# EAGLE design SparkFun_Beefcake_Relay_Control_Kit (EAGLE 7.5.0)
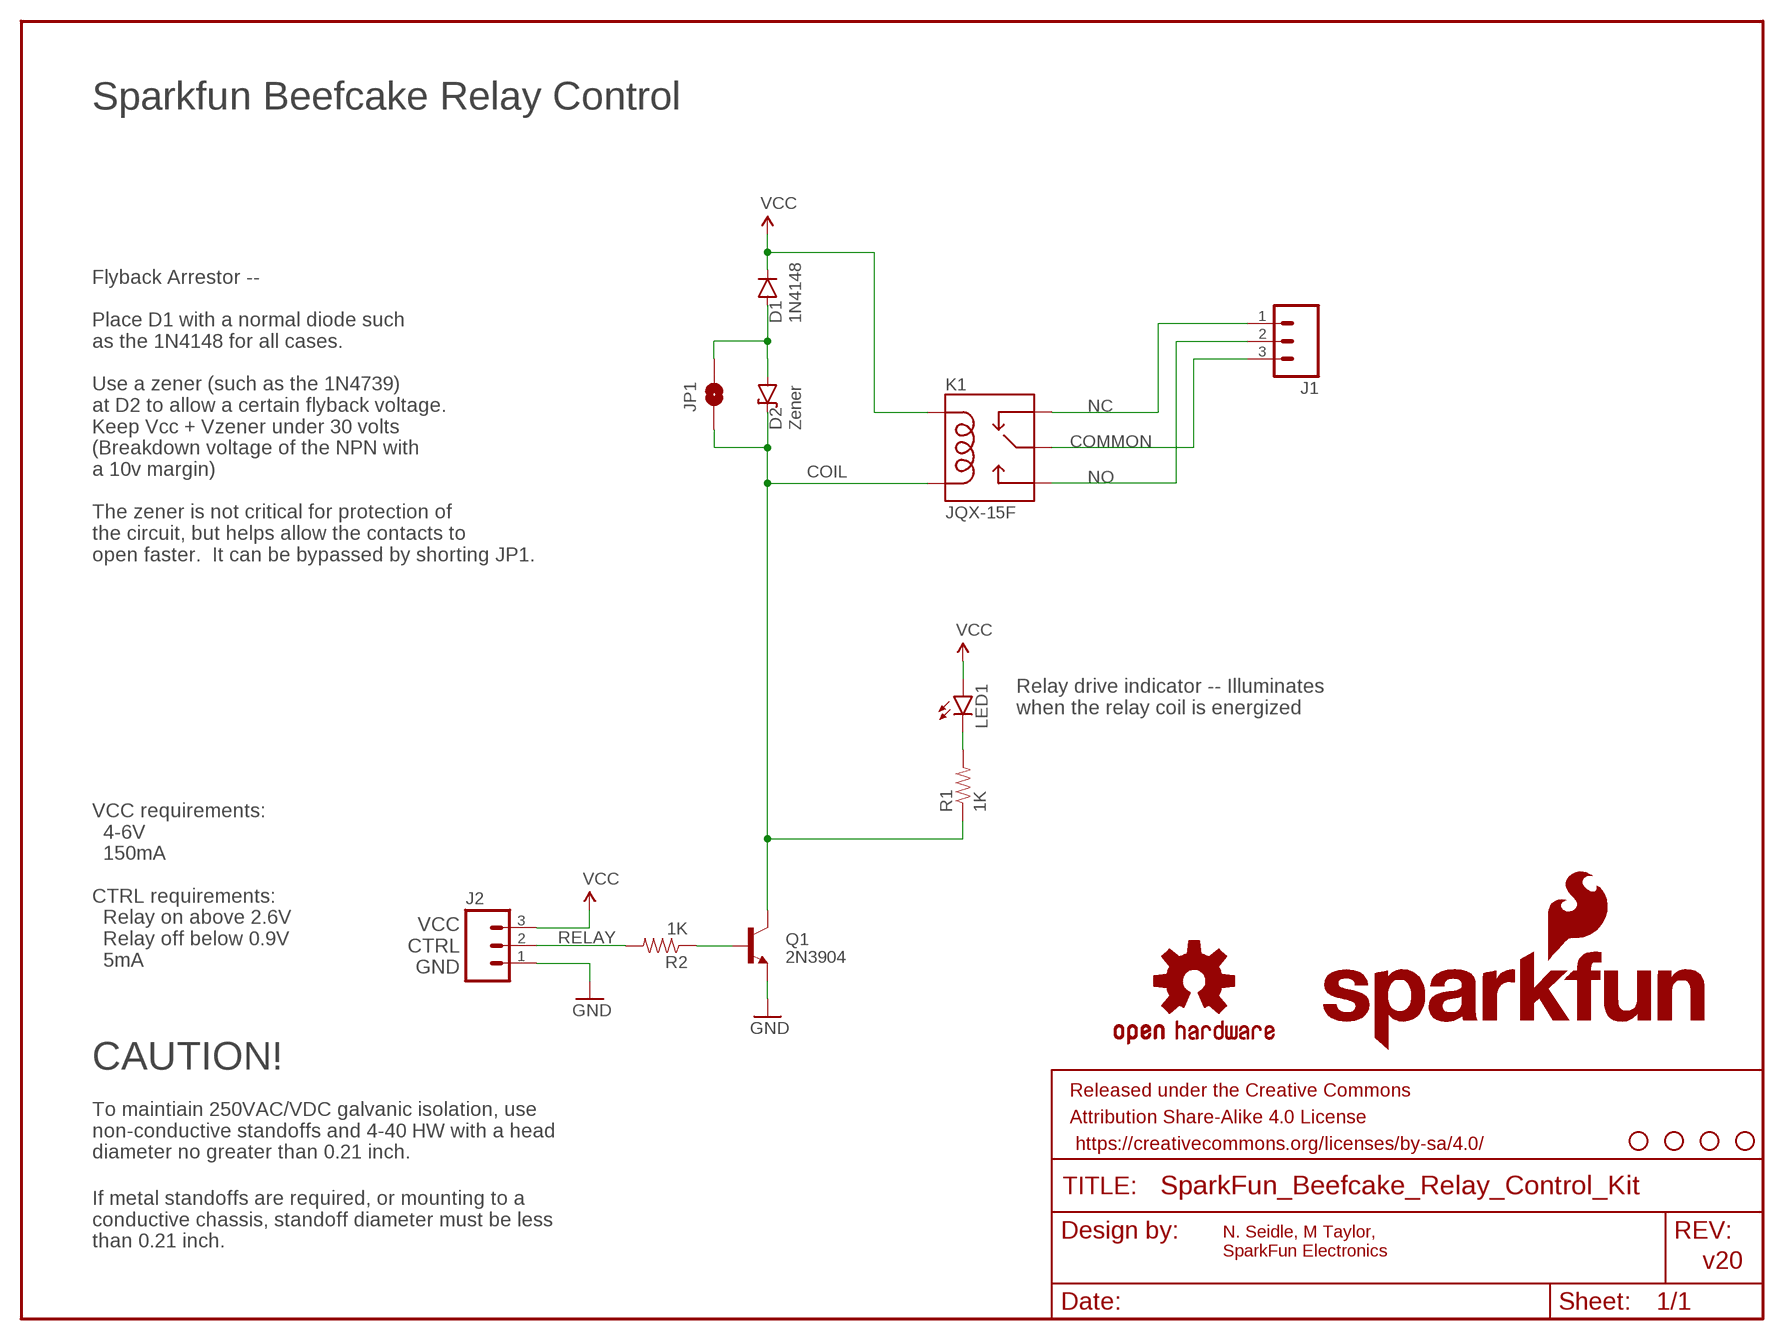
[diagram p0: schematic, sheet 1]

## Parts
D1  1N4148  DIODEKIT  [DIODE-1N4148-KIT]
D2  Zener  DIODE-ZENER  [DIODE-1N4148-KIT]
FRAME2  FRAME-LETTER  [CREATIVE_COMMONS]
J1  M03-SCREW-5MM  [SCREWTERMINAL-5MM-3]
J2  M03SCREW  [SCREWTERMINAL-3.5MM-3]
JP1  JUMPER-PAD-2-NOYES_SILK  [PAD-JUMPER-2-NO_YES_SILK]
K1  JQX-15F  RELAYPTH5  [RELAY-T90]
LED1  LED5MM-KIT  [LED5MM-KIT]
LOGO1  SFE_LOGO_NAME_FLAME.1_INCH  [SFE_LOGO_NAME_FLAME_.1]
Q1  2N3904  TRANSISTOR_NPN2N3904-EZ  [TO-92-EZ]
R1  1K  1KOHM-1/4W-1%(PTH)HORIZ-KIT  [AXIAL-0.3EZ]
R2  1K  1KOHM-1/4W-1%(PTH)HORIZ-KIT  [AXIAL-0.3EZ]
U$3  STAND-OFF  [STAND-OFF]
U$4  STAND-OFF  [STAND-OFF]
U$5  STAND-OFF  [STAND-OFF]
U$7  STAND-OFF  [STAND-OFF]
U$12  OSHW-LOGOS  [OSHW-LOGO-S]

## Nets
COIL: D2.C JP1.1 K1.COIL2 Q1.3(C) R1.P$1
COMMON: J1.3 K1.MAIN
DIODENODE: D1.A D2.A JP1.2
GND: J2.1 Q1.1(E)
N$6: Q1.2(B) R2.P$1
N$9: LED1.K(C) R1.P$2
NC: J1.1 K1.NC
NO: J1.2 K1.NO
RELAY: J2.2 R2.P$2
VCC: D1.C J2.3 K1.COIL1 LED1.A

## Notes on the sheet
- Sparkfun Beefcake Relay Control
- Flyback Arrestor --
  
  Place D1 with a normal diode such
  as the 1N4148 for all cases.
  
  Use a zener (such as the 1N4739)
  at D2 to allow a certain flyback voltage.
  Keep Vcc + Vzener under 30 volts
  (Breakdown voltage of the NPN with
  a 10v margin)
  
  The zener is not critical for protection of
  the circuit, but helps allow the contacts to
  open faster.  It can be bypassed by shorting JP1.
- Relay drive indicator -- Illuminates
  when the relay coil is energized
- VCC requirements:
    4-6V
    150mA
  
  CTRL requirements:
    Relay on above 2.6V
    Relay off below 0.9V
    5mA
- VCC
  CTRL
  GND
- CAUTION!
- To maintiain 250VAC/VDC galvanic isolation, use 
  non-conductive standoffs and 4-40 HW with a head
  diameter no greater than 0.21 inch.
- If metal standoffs are required, or mounting to a
  conductive chassis, standoff diameter must be less
  than 0.21 inch.
- N. Seidle, M Taylor,
  SparkFun Electronics
- v20

## Library data of the parts
D1 = SparkFun-DiscreteSemi:DIODE: Diode These are standard reverse protection diodes and small signal diodes. SMA package can handle up to about 1A. SOD-323 can handle about 200mA. What the SOD-323 package when ordering, there are some mfgs out there that are 5-pin packages.; PROD_ID: DIO-08378
D2 = SparkFun-DiscreteSemi:DIODE-ZENER: Zener Diode Production Part - 8199 3.4V Zener Voltage; PROD_ID: DIO-13313
FRAME2 = SparkFun-Aesthetics:FRAME-LETTER: Schematic Frame Standard 8.5x11 US Letter frame
J1 = SparkFun-Connectors:M03: Header 3 Standard 3-pin 0.1" header. Use with straight break away headers (SKU : PRT-00116), right angle break away headers (PRT-00553), swiss pins (PRT-00743), machine pins (PRT-00117), and female headers (PRT-00115). Molex polarized connector foot print use with SKU : PRT-08232 with associated crimp pins and housings.; PROD_ID: CONN-10134; STOREFRONT_ID: PRT-08433
J2 = SparkFun-Connectors:M03: Header 3 Standard 3-pin 0.1" header. Use with straight break away headers (SKU : PRT-00116), right angle break away headers (PRT-00553), swiss pins (PRT-00743), machine pins (PRT-00117), and female headers (PRT-00115). Molex polarized connector foot print use with SKU : PRT-08232 with associated crimp pins and housings.; PROD_ID: CONN-08288
JP1 = SparkFun-Passives:JUMPER-PAD-2-NO
K1 = SparkFun-Electromechanical:RELAY: SPDT relay (COM-00101); PROD_ID: COMP-10736
LED1 = SparkFun-LED:LED: LEDs Standard schematic elements and footprints for 5mm, 3mm, 1206, and 0603 sized LEDs. 5mm - Spark Fun Electronics SKU : COM-00529 (and others); PROD_ID: DIO-09529
LOGO1 = SparkFun-Aesthetics:SFE_LOGO_NAME_FLAME: SFE Logo, name and flame This is the SparkFun full logo. The logo on the schematic will always be the same size; the package variant is the height of the flame part of the logo. Default layer for the logo on the board is tSilk.
Q1 = SparkFun-DiscreteSemi:TRANSISTOR_NPN: Generic NPN BJT MMBT2222A - TRANS-08049 (SOT-23, 1A 40V) MPSA42 - TRANS-09116 (SOT-23, 500mA 300V) MMBT5088LT1G - TRANS-11160 (SOT-23, 50 mA 30V) BC547 - COM-08928 <http://www.sparkfun.com/products/8928> (TO-92 45V 100mA) (1.Collector 2.Base 3.Emitter) 2N3904 - COM-00521 <http://www.sparkfun.com/products/521> (TO-92 40V 200mA) (1.Emitter 2.Base 3.Collector) P2N2222A - COM-12852 <http://www.sparkfun.com/products/12852> (TO-92 40V 600mA) (1.Collector 2.Base 3.Emitter); PROD_ID: TRANS-08447
R1 R2 = SparkFun-Resistors:1KOHM-1/4W-1%(PTH): RES-12182; PROD_ID: RES-12182
U$3-U$5 U$7 = SparkFun:STAND-OFF: Stand Off This is the mechanical footprint for a #4 phillips button head screw. Use the keepout ring to avoid running the screw head into surrounding components. SKU : PRT-00447
U$12 = SparkFun:OSHW-LOGO: Open Source Hardware Logo This logo indicates the piece of hardware it is found on incorporates a OSHW license and/or adheres to the definition of open source hardware found here: http://freedomdefined.org/OSHW

## Board
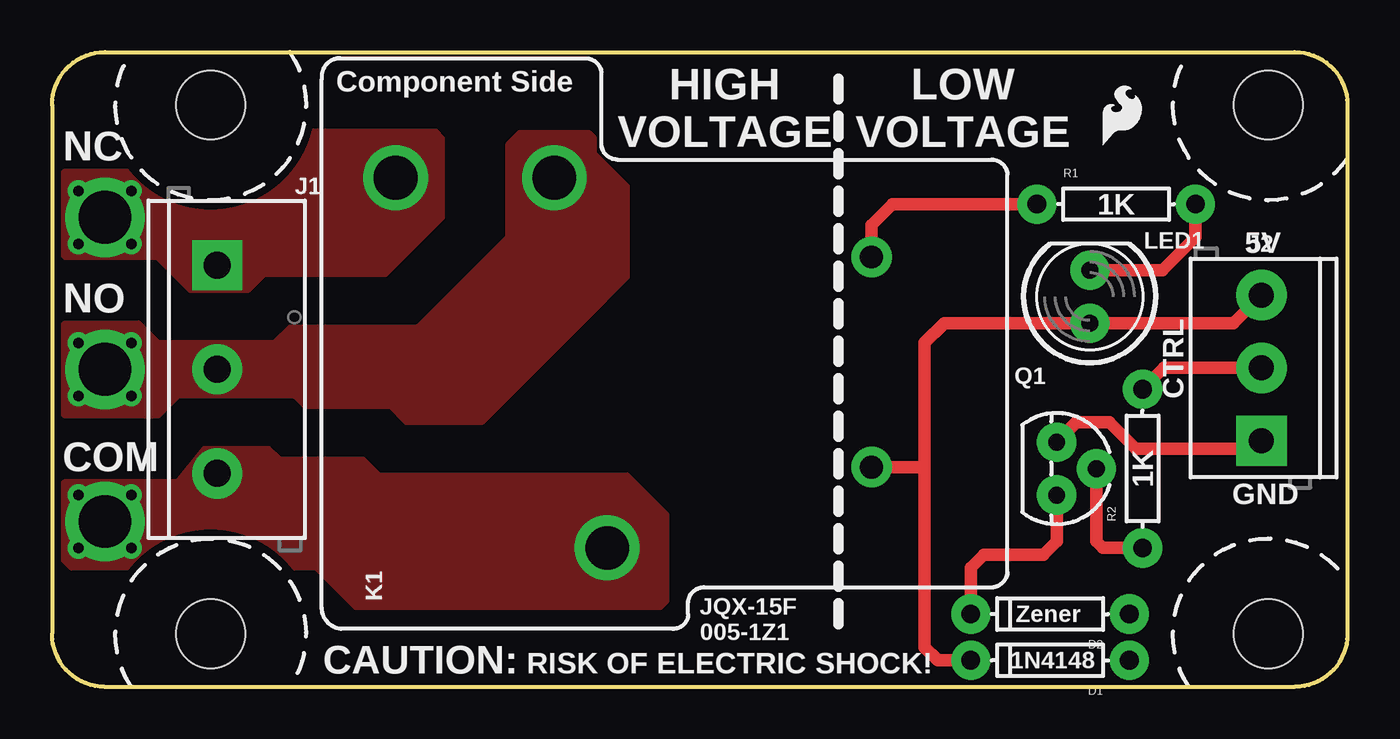
[diagram p1: board, top side]
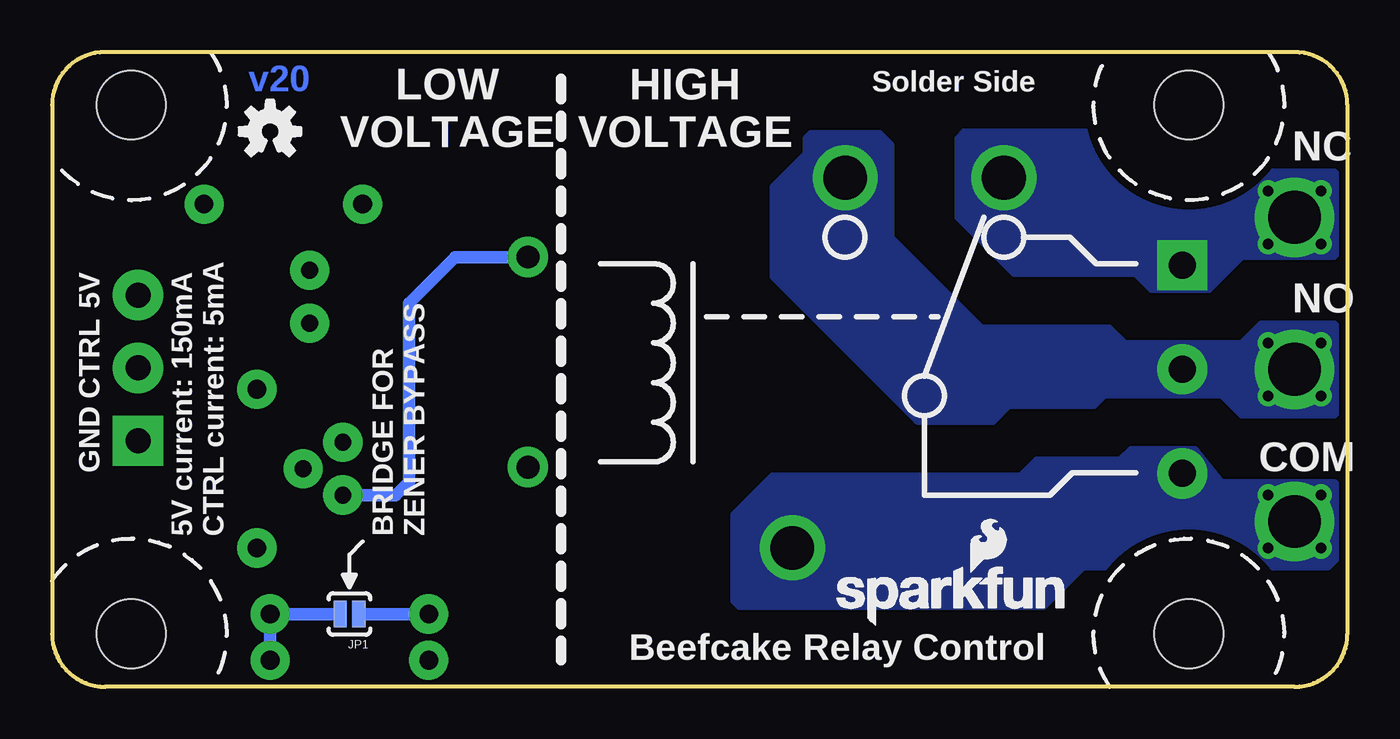
[diagram p2: board, bottom side, seen from below]

Size 62.23 x 30.48 mm. Coordinates in mm from the lower left corner, seen from the top.
Outline: 2.54,30.48 59.69,30.48 arc-90 62.23,27.94 62.23,2.54 arc-90 59.69,0 2.54,0 arc-90 0,2.54 0,27.94 arc-90 2.54,30.48
Copper layers (1*16): Top 0.035mm / dielectric 1.5mm / Bottom 0.035mm
Design rules "SparkFun-2-layer-STANDARD": minimum track width 10mil, minimum drill 20mil, track to track 10mil, track to pad 8mil, pad to pad 8mil, via to via 10mil, smd to smd 8mil, copper to edge 8mil, drill to drill 8mil, minimum pad ring 10mil, minimum via ring 10mil, stop-mask expansion 4mil, vias tented up to drill 20mil, thermal gap 10mil
tRestrict: area 3,23.4 to 12.2,32.5; area 53.8,23.4 to 63,32.5; area 53.8,-2 to 63,7.1; area 3,-2 to 12.2,7.1
bRestrict: area 3,23.4 to 12.2,32.5; area 3,-2 to 12.2,7.1; area 53.8,23.4 to 63,32.5; area 53.8,-2 to 63,7.1

### Footprints (pad centres in the part's own frame; a part is rotated, then mirrored left to right if it is on the bottom)
DIODE-1N4148-KIT = drill 0.9 pad 1.88: A -3.81,0; C 3.81,0
SCREWTERMINAL-5MM-3 = drill 1.3 pad 2.413 square: 1 0,0 | drill 1.3 pad 2.413: 2 5,0; 3 10,0
SCREWTERMINAL-3.5MM-3 = drill 1.2 pad 2.413 square: 1 0,0 | drill 1.2 pad 2.413: 2 3.5,0; 3 7,0
PAD-JUMPER-2-NO_YES_SILK = smd 0.635 x 1.27: 1 -0.45,0; 2 0.45,0
RELAY-T90 = drill 1.1 pad 1.956: COIL1 0,-13.9; COIL2 0,-3.81 | drill 2.1: MAIN -12.7,-17.78; NC -22.86,0; NO -15.24,0
LED5MM-KIT = drill 0.813 pad 1.88: A -1.27,0; K 1.27,0
TO-92-EZ = drill 0.813 pad 1.88: 1 -1.27,0; 2 0,1.905; 3 1.27,0
AXIAL-0.3EZ = drill 0.9 pad 1.88: P$1 -3.81,0; P$2 3.81,0
STAND-OFF = hole 3.302: 0,0

### Placement (x,y rotation side)
D1  47.94,1.27 180 top
D2  47.94,3.49 180 top
FRAME2  -1.14,-13.08 0 top  (outside the outline)
J1  7.94,20.24 270 top
J2  58.1,11.81 90 top
JP1  47.94,3.49 180 bottom
K1  39.37,24.45 0 top
LED1  49.85,18.73 90 top
LOGO1  24.96,2.86 0 bottom
Q1  48.26,10.48 270 top
R1  51.12,23.18 0 top
R2  52.39,10.48 90 top
U$3  7.62,2.54 0 top
U$4  58.42,2.54 0 top
U$5  58.42,27.94 0 top
U$7  7.62,27.94 0 top
U$11  [SFE-LOGO-FLAME]  50.48,26.04 0 top
U$12  51.75,26.67 0 bottom

### Tracks (layer width: path | path; a pad name or v marks a point on that pad's centre or on a via)
COIL
  Top 0.61: Q1.3 48.26,6.99 47.62,6.35 44.77,6.35 44.13,5.71 D2.C | R1.P$1 40.38,23.18 39.37,22.17 K1.COIL2
  Bottom 0.61: Q1.3 45.72,9.21 45.09,9.84 45.09,18.41 42.86,20.64 K1.COIL2 | JP1.1 D2.C
COMMON  (via drill 0.51, 2.54 pad 3.81)
  other vias: 2.54,7.94 1.27,9.21 3.81,9.21 1.27,6.67 3.81,6.67
  pour Top (isolate 0.305, no thermals): 14.61,3.81 29.21,3.81 29.53,4.13 29.53,8.26 27.62,10.16 15.68,10.16 14.92,10.92 10.92,10.92 10.41,11.43 7.3,11.43 6.03,9.84 0.64,9.84 0.32,9.53 0.32,6.35 0.95,5.71 12.7,5.71
  pour Bottom (isolate 0.305, no thermals): 14.61,3.81 29.21,3.81 29.53,4.13 29.53,8.26 27.62,10.16 15.68,10.16 14.92,10.92 10.92,10.92 10.41,11.43 7.3,11.43 6.03,9.84 0.64,9.84 0.32,9.53 0.32,6.35 0.95,5.71 12.7,5.71
DIODENODE
  Bottom 0.61: JP1.2 D2.A D1.A
GND
  Top 0.61: Q1.1 49.21,12.7 50.8,12.7 52.07,11.43 57.72,11.43 J2.1
N$6
  Top 0.61: Q1.2 50.16,6.99 50.48,6.67 R2.P$1
N$9
  Top 0.61: LED1.K 53.34,20 54.93,21.59 R1.P$2
NC  (via drill 0.51, 2.54 pad 3.81)
  other vias: 2.54,22.54 1.27,23.81 3.81,23.81 1.27,21.27 3.81,21.27
  pour Top (isolate 0.305, no thermals): 18.73,26.35 18.73,22.54 16,19.81 10.16,19.81 9.4,19.05 6.67,19.05 5.08,20.64 0.64,20.64 0.32,20.95 0.32,24.45 0.64,24.77 10.41,24.77 12.32,26.67 18.41,26.67
  pour Bottom (isolate 0.305, no thermals): 18.73,26.35 18.73,22.54 16,19.81 10.16,19.81 9.4,19.05 6.67,19.05 5.08,20.64 0.64,20.64 0.32,20.95 0.32,24.45 0.64,24.77 10.41,24.77 12.32,26.67 18.41,26.67
NO  (via drill 0.51, 2.54 pad 3.81)
  other vias: 2.54,15.24 1.27,16.51 3.81,16.51 1.27,13.97 3.81,13.97
  pour Top (isolate 0.305, no thermals): 22.48,26.61 25.78,26.61 26.04,26.35 26.04,25.59 27.62,24 27.62,19.68 20.64,12.7 17.02,12.7 16.26,13.46 12.19,13.46 11.68,13.97 6.03,13.97 5.08,13.02 0.64,13.02 0.32,13.34 0.32,17.14 0.64,17.46 4.13,17.46 5.08,16.51 10.67,16.51 11.43,17.27 17.59,17.27 21.91,21.59 21.91,26.04
  pour Bottom (isolate 0.305, no thermals): 22.48,26.61 25.78,26.61 26.04,26.35 26.04,25.59 27.62,24 27.62,19.68 20.64,12.7 17.02,12.7 16.26,13.46 12.19,13.46 11.68,13.97 6.03,13.97 5.08,13.02 0.64,13.02 0.32,13.34 0.32,17.14 0.64,17.46 4.13,17.46 5.08,16.51 10.67,16.51 11.43,17.27 17.59,17.27 21.91,21.59 21.91,26.04
RELAY
  Top 0.61: J2.2 53.41,15.31 R2.P$2
VCC
  Top 0.61: D1.C 42.55,1.27 41.91,1.91 41.91,10.55 | J2.3 56.75,17.46 LED1.A 42.86,17.46 41.91,16.51 41.91,12.38 41.91,10.55 | K1.COIL1 41.91,10.55

### Text on the board
Bottom: v20
tPlace: Component Side | HIGH / VOLTAGE | LOW / VOLTAGE | NC | 5V | NO | CTRL | COM | GND | JQX-15F / 005-1Z1 | CAUTION: | RISK OF ELECTRIC SHOCK!
bPlace: Solder Side | HIGH / VOLTAGE | LOW / VOLTAGE | NC | NO | 5V | CTRL | COM | GND | BRIDGE FOR / ZENER BYPASS | 5V current: 150mA / CTRL current: 5mA | Beefcake Relay Control
Measures: Units in inches
tDocu: Both layers to be 2 OZ copper | N. Seidle/M. Taylor